# Altium schematic sheet Blues Brkr.SchDoc (part 3 of 3)
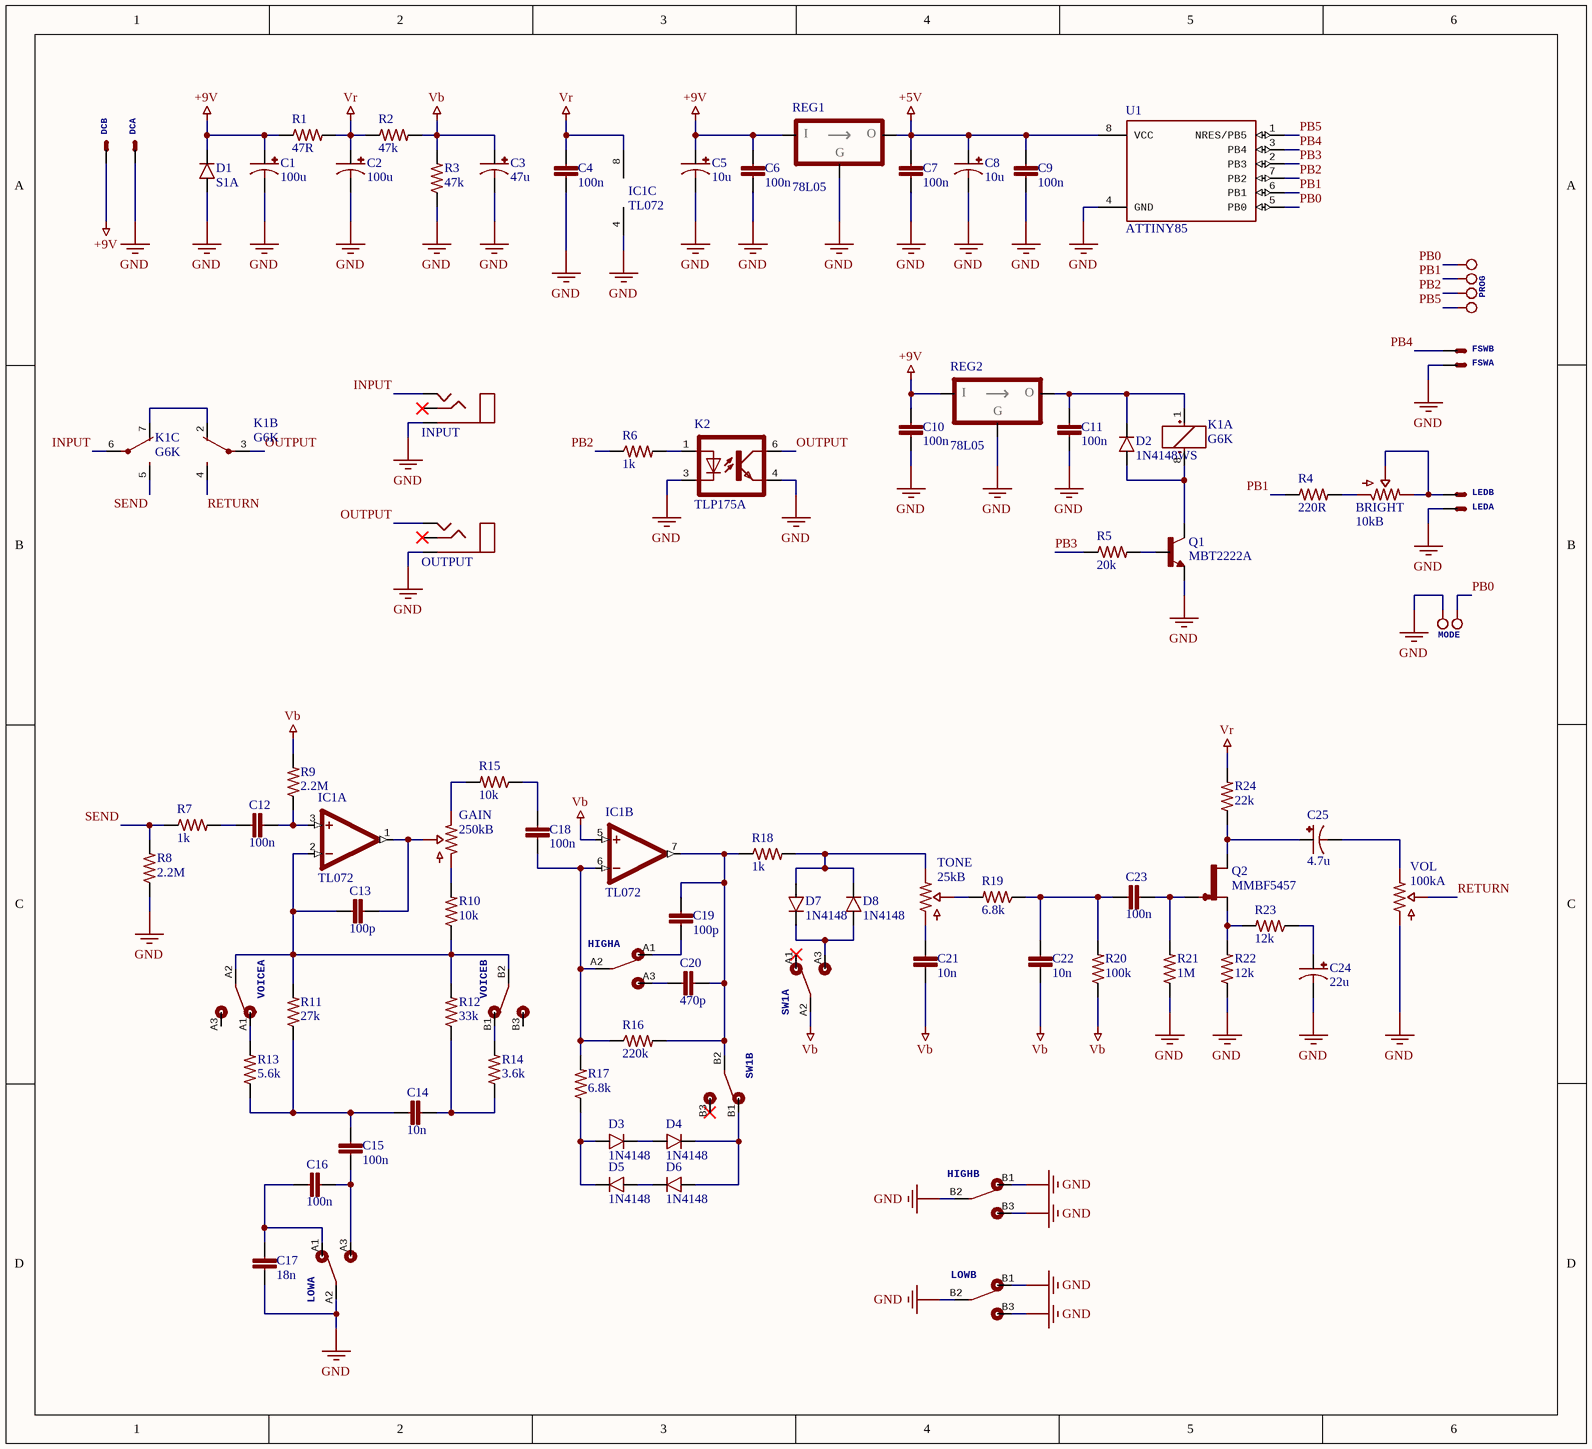
[diagram p2: Blues Brkr.SchDoc]

## Library data of the parts (continued)
R6 R7 R18 = CRCW06031K00FKEA: RES SMD 1K OHM 1% 1/10W 0603; Manufacturer: Vishay Dale; Resistance: 1kR; Temperature Coefficient: 100ppm/°C; Power Rating: 100mW; Voltage Rating: 75V; Supplier 1: Farnell; Supplier Part Number 1: 1469740; Manufacturer Part Number: CRCW06031K00FKEA; Stock: 1083345; Pricing: 10=0.017, 100=0.0131, 500=0.0114, 1000=0.008, 2500=0.0061 (EUR); RoHS: Yes; Mount: Surface Mount; Case/Package: 0603; Number of Pins: 2; Weight: 7.1E-05oz; Contact Plating: Tin; Case Code (Metric): 1608; Case Code (Imperial): 0603; Min Operating Temperature: -55°C; Max Operating Temperature: 155°C; Composition: Thick Film; Tolerance: 1%; Termination: SMD/SMT; Packaging: Tape and Reel; Package Quantity: 10; Number of Terminations: 2; Military Standard: Not; Max Power Dissipation: 100mW; Voltage Rating (DC): 75V; Features: Automotive AEC-Q200; Length: 1.55mm; Height: 0.45mm; Width: 0.033inch; Depth: 0.85mm; Radiation Hardening: No; Lead Free: Lead Free; REACH SVHC: Unknown; ComponentLink1URL: https://datasheet.ciiva.com/11808/0900766b80d98afc-11808625.pdf?src-supplier=RSComponents; ComponentLink1Description: https://datasheet.ciiva.com/11808/0900766b80d98afc-11808625.pdf?src-supplier=RSComponents; ComponentLink2URL: https://datasheet.ciiva.com/2465/dcrcwe3-2465536.pdf?src-supplier=Digi-Key; ComponentLink2Description: https://datasheet.ciiva.com/2465/dcrcwe3-2465536.pdf?src-supplier=Digi-Key; ComponentLink3URL: https://datasheet.ciiva.com/8336/dcrcwe3-8336822.pdf?src-supplier=Avnet; ComponentLink3Description: https://datasheet.ciiva.com/8336/dcrcwe3-8336822.pdf?src-supplier=Avnet; ComponentLink4URL: https://datasheet.ciiva.com/16515/dcrcwe3-16515078.pdf?src-supplier=Avnet+Asia; ComponentLink4Description: https://datasheet.ciiva.com/16515/dcrcwe3-16515078.pdf?src-supplier=Avnet+Asia; ComponentLink5URL: https://datasheet.ciiva.com/46441/1720486-46441622.pdf?src-supplier=Element14; ComponentLink5Description: https://datasheet.ciiva.com/46441/1720486-46441622.pdf?src-supplier=Element14; ComponentLink6URL: https://datasheet.ciiva.com/26316/fld-crcw-e3-data-en-26316551.pdf?src-supplier=Distrelec; ComponentLink6Description: https://datasheet.ciiva.com/26316/fld-crcw-e3-data-en-26316551.pdf?src-supplier=Distrelec; ComponentLink7URL: https://datasheet.ciiva.com/46441/1720486-46441623.pdf?src-supplier=Element14; ComponentLink7Description: https://datasheet.ciiva.com/46441/1720486-46441623.pdf?src-supplier=Element14; ComponentLink8URL: https://datasheet.ciiva.com/46385/1697337-46385497.pdf?src-supplier=Element14; ComponentLink8Description: https://datasheet.ciiva.com/46385/1697337-46385497.pdf?src-supplier=Element14; ComponentLink9URL: https://datasheet.ciiva.com/3257/dcrcwe3-3257132.pdf?src-supplier=Avnet; ComponentLink9Description: https://datasheet.ciiva.com/3257/dcrcwe3-3257132.pdf?src-supplier=Avnet; ComponentLink10URL: https://datasheet.ciiva.com/16199/dcrcwe3-16199053.pdf?src-supplier=Future+Electronics; ComponentLink10Description: https://datasheet.ciiva.com/16199/dcrcwe3-16199053.pdf?src-supplier=Future+Electronics; ComponentLink11URL: https://datasheet.ciiva.com/2465/dcrcwe3-2465534.pdf?src-supplier=Digi-Key; ComponentLink11Description: https://datasheet.ciiva.com/2465/dcrcwe3-2465534.pdf?src-supplier=Digi-Key; ComponentLink12URL: https://datasheet.ciiva.com/16893/dcrcwe3-16893742.pdf?src-supplier=Avnet+Europe; ComponentLink12Description: https://datasheet.ciiva.com/16893/dcrcwe3-16893742.pdf?src-supplier=Avnet+Europe; ComponentLink13URL: https://datasheet.ciiva.com/2465/dcrcwe3-2465535.pdf?src-supplier=Digi-Key; ComponentLink13Description: https://datasheet.ciiva.com/2465/dcrcwe3-2465535.pdf?src-supplier=Digi-Key; Price: 0.013
R8 R9 = CRCW06032M20FKEA: RES SMD 2.2M OHM 1% 1/10W 0603; Manufacturer: Vishay; Resistance: 2.2MR; Power Rating: 100mW; Temperature Coefficient: 100ppm/°C; Voltage Rating: 75V; Supplier 1: Farnell; Supplier Part Number 1: 2138646; Manufacturer Part Number: CRCW06032M20FKEA; Stock: 19125; Pricing: 10=0.0212, 100=0.0163, 500=0.0141, 1000=0.0073 (EUR); RoHS: Yes; Mount: Surface Mount; Case/Package: 0603; Number of Pins: 2; Weight: 7.1E-05oz; Contact Plating: Tin; Case Code (Imperial): 0603; Case Code (Metric): 1608; Min Operating Temperature: -55°C; Max Operating Temperature: 155°C; Tolerance: 1%; Packaging: Tape and Reel; Composition: Thick Film; Termination: SMD/SMT; Package Quantity: 10; Number of Terminations: 2; Military Standard: Not; Max Power Dissipation: 100mW; Voltage Rating (DC): 75V; Features: Automotive AEC-Q200; Length: 1.55mm; Height: 0.45mm; Width: 0.85mm; Depth: 0.85mm; Radiation Hardening: No; Lead Free: Lead Free; REACH SVHC: Unknown; ComponentLink1URL: https://datasheet.ciiva.com/11810/0900766b80d98afc-11810588.pdf?src-supplier=RSComponents; ComponentLink1Description: https://datasheet.ciiva.com/11810/0900766b80d98afc-11810588.pdf?src-supplier=RSComponents; ComponentLink2URL: https://datasheet.ciiva.com/2466/dcrcwe3-2466118.pdf?src-supplier=Digi-Key; ComponentLink2Description: https://datasheet.ciiva.com/2466/dcrcwe3-2466118.pdf?src-supplier=Digi-Key; ComponentLink3URL: https://datasheet.ciiva.com/22682/1912744-22682662.pdf?src-supplier=Element14; ComponentLink3Description: https://datasheet.ciiva.com/22682/1912744-22682662.pdf?src-supplier=Element14; ComponentLink4URL: https://datasheet.ciiva.com/7801/1697337-7801067.pdf?src-supplier=Element14; ComponentLink4Description: https://datasheet.ciiva.com/7801/1697337-7801067.pdf?src-supplier=Element14; ComponentLink5URL: https://datasheet.ciiva.com/22869/70201119-22869819.pdf?src-supplier=Allied+Electronics; ComponentLink5Description: https://datasheet.ciiva.com/22869/70201119-22869819.pdf?src-supplier=Allied+Electronics; ComponentLink6URL: https://datasheet.ciiva.com/26314/fld-crcw-e3-data-en-26314653.pdf?src-supplier=Distrelec; ComponentLink6Description: https://datasheet.ciiva.com/26314/fld-crcw-e3-data-en-26314653.pdf?src-supplier=Distrelec; ComponentLink7URL: https://datasheet.ciiva.com/3257/dcrcwe3-3257407.pdf?src-supplier=Avnet; ComponentLink7Description: https://datasheet.ciiva.com/3257/dcrcwe3-3257407.pdf?src-supplier=Avnet; ComponentLink8URL: https://datasheet.ciiva.com/2466/dcrcwe3-2466116.pdf?src-supplier=Digi-Key; ComponentLink8Description: https://datasheet.ciiva.com/2466/dcrcwe3-2466116.pdf?src-supplier=Digi-Key; ComponentLink9URL: https://datasheet.ciiva.com/2466/dcrcwe3-2466117.pdf?src-supplier=Digi-Key; ComponentLink9Description: https://datasheet.ciiva.com/2466/dcrcwe3-2466117.pdf?src-supplier=Digi-Key; ComponentLink10URL: https://datasheet.ciiva.com/16498/dcrcwe3-16498313.pdf?src-supplier=Future+Electronics; ComponentLink10Description: https://datasheet.ciiva.com/16498/dcrcwe3-16498313.pdf?src-supplier=Future+Electronics; ComponentLink11URL: https://datasheet.ciiva.com/7801/1697337-7801066.pdf?src-supplier=Element14; ComponentLink11Description: https://datasheet.ciiva.com/7801/1697337-7801066.pdf?src-supplier=Element14; Price: 0.0165
R10 R15 = CRCW060310K0FKEA: RES SMD 10K OHM 1% 1/10W 0603; Manufacturer: Vishay; Resistance: 10kR; Temperature Coefficient: 100ppm/°C; Power Rating: 100mW; Voltage Rating: 75V; Supplier 1: Farnell; Supplier Part Number 1: 1469748; Manufacturer Part Number: CRCW060310K0FKEA; Stock: 1391124; Pricing: 10=0.0169, 100=0.013, 500=0.0113, 1000=0.008 (EUR); RoHS: Yes; Case/Package: 0603; Number of Pins: 2; Weight: 7.1E-05oz; Contact Plating: Tin; Case Code (Metric): 1608; Case Code (Imperial): 0603; Min Operating Temperature: -55°C; Max Operating Temperature: 155°C; Tolerance: 1%; Composition: Thick Film; Packaging: Tape and Reel; Package Quantity: 10; Number of Terminations: 2; Military Standard: Not; Termination: SMD/SMT; Max Power Dissipation: 100mW; Voltage Rating (DC): 75V; Features: Automotive AEC-Q200; Length: 1.55mm; Height: 0.45mm; Width: 0.033inch; Depth: 0.85mm; Radiation Hardening: No; Lead Free: Lead Free; REACH SVHC: Unknown; ComponentLink1URL: https://datasheet.ciiva.com/11809/0900766b80d98afc-11809037.pdf?src-supplier=RSComponents; ComponentLink1Description: https://datasheet.ciiva.com/11809/0900766b80d98afc-11809037.pdf?src-supplier=RSComponents; ComponentLink2URL: https://datasheet.ciiva.com/16886/dcrcw-16886037.pdf?src-supplier=Avnet+Europe; ComponentLink2Description: https://datasheet.ciiva.com/16886/dcrcw-16886037.pdf?src-supplier=Avnet+Europe; ComponentLink3URL: https://datasheet.ciiva.com/26821/getdatasheetpartid-86831-26821109.pdf?src-supplier=Verical; ComponentLink3Description: https://datasheet.ciiva.com/26821/getdatasheetpartid-86831-26821109.pdf?src-supplier=Verical; ComponentLink4URL: https://datasheet.ciiva.com/16754/70201119-16754710.pdf?src-supplier=Allied+Electronics; ComponentLink4Description: https://datasheet.ciiva.com/16754/70201119-16754710.pdf?src-supplier=Allied+Electronics; ComponentLink5URL: https://datasheet.ciiva.com/16719/70201119-16719704.pdf?src-supplier=Allied+Electronics; ComponentLink5Description: https://datasheet.ciiva.com/16719/70201119-16719704.pdf?src-supplier=Allied+Electronics; ComponentLink6URL: https://datasheet.ciiva.com/2465/dcrcwe3-2465513.pdf?src-supplier=Digi-Key; ComponentLink6Description: https://datasheet.ciiva.com/2465/dcrcwe3-2465513.pdf?src-supplier=Digi-Key; ComponentLink7URL: https://datasheet.ciiva.com/5543/dcrcwe3-109170-5543001.pdf?src-supplier=Mouser; ComponentLink7Description: https://datasheet.ciiva.com/5543/dcrcwe3-109170-5543001.pdf?src-supplier=Mouser; ComponentLink8URL: https://datasheet.ciiva.com/2465/dcrcwe3-2465514.pdf?src-supplier=Digi-Key; ComponentLink8Description: https://datasheet.ciiva.com/2465/dcrcwe3-2465514.pdf?src-supplier=Digi-Key; ComponentLink9URL: https://datasheet.ciiva.com/46385/1697337-46385498.pdf?src-supplier=Element14; ComponentLink9Description: https://datasheet.ciiva.com/46385/1697337-46385498.pdf?src-supplier=Element14; ComponentLink10URL: https://datasheet.ciiva.com/2465/dcrcwe3-2465515.pdf?src-supplier=Digi-Key; ComponentLink10Description: https://datasheet.ciiva.com/2465/dcrcwe3-2465515.pdf?src-supplier=Digi-Key; ComponentLink11URL: https://datasheet.ciiva.com/3256/dcrcwe3-3256939.pdf?src-supplier=Avnet; ComponentLink11Description: https://datasheet.ciiva.com/3256/dcrcwe3-3256939.pdf?src-supplier=Avnet; ComponentLink12URL: https://datasheet.ciiva.com/3256/dcrcwe3-3256940.pdf?src-supplier=Avnet; ComponentLink12Description: https://datasheet.ciiva.com/3256/dcrcwe3-3256940.pdf?src-supplier=Avnet; ComponentLink13URL: https://datasheet.ciiva.com/16209/dcrcwe3-16209164.pdf?src-supplier=Future+Electronics; ComponentLink13Description: https://datasheet.ciiva.com/16209/dcrcwe3-16209164.pdf?src-supplier=Future+Electronics; ComponentLink14URL: https://datasheet.ciiva.com/26314/fld-crcw-e3-data-en-26314749.pdf?src-supplier=Distrelec; ComponentLink14Description: https://datasheet.ciiva.com/26314/fld-crcw-e3-data-en-26314749.pdf?src-supplier=Distrelec; Price: 0.0131
R11 = CRCW060327K0FKEA: RES SMD 27K OHM 1% 1/10W 0603; Manufacturer: Vishay; Resistance: 27kR; Power Rating: 100mW; Temperature Coefficient: 100ppm/°C; Voltage Rating: 75V; Supplier 1: Farnell; Supplier Part Number 1: 1652864; Manufacturer Part Number: CRCW060327K0FKEA; Stock: 74674; Pricing: 10=0.0169, 100=0.013, 500=0.0113, 1000=0.0068 (EUR); RoHS: Yes; Mount: Surface Mount; Case/Package: 0603; Number of Pins: 2; Weight: 7.1E-05oz; Contact Plating: Tin; Case Code (Imperial): 0603; Case Code (Metric): 1608; Min Operating Temperature: -55°C; Max Operating Temperature: 155°C; Tolerance: 1%; Composition: Thick Film; Packaging: Tape and Reel; Termination: SMD/SMT; Package Quantity: 10; Number of Terminations: 2; Military Standard: Not; Max Power Dissipation: 100mW; Voltage Rating (DC): 75V; Features: Automotive AEC-Q200; Length: 1.55mm; Height: 0.45mm; Width: 0.85mm; Depth: 0.85mm; Radiation Hardening: No; REACH SVHC: Unknown; Lead Free: Lead Free; ComponentLink1URL: https://datasheet.ciiva.com/11810/0900766b80d98afc-11810797.pdf?src-supplier=RSComponents; ComponentLink1Description: https://datasheet.ciiva.com/11810/0900766b80d98afc-11810797.pdf?src-supplier=RSComponents; ComponentLink2URL: https://datasheet.ciiva.com/7841/1697337-7841575.pdf?src-supplier=Element14; ComponentLink2Description: https://datasheet.ciiva.com/7841/1697337-7841575.pdf?src-supplier=Element14; ComponentLink3URL: https://datasheet.ciiva.com/15159/getdatasheetpartid-45808-15159562.pdf?src-supplier=Verical; ComponentLink3Description: https://datasheet.ciiva.com/15159/getdatasheetpartid-45808-15159562.pdf?src-supplier=Verical; ComponentLink4URL: https://datasheet.ciiva.com/26314/fld-crcw-e3-data-en-26314668.pdf?src-supplier=Distrelec; ComponentLink4Description: https://datasheet.ciiva.com/26314/fld-crcw-e3-data-en-26314668.pdf?src-supplier=Distrelec; ComponentLink5URL: https://datasheet.ciiva.com/2466/dcrcwe3-2466269.pdf?src-supplier=Digi-Key; ComponentLink5Description: https://datasheet.ciiva.com/2466/dcrcwe3-2466269.pdf?src-supplier=Digi-Key; ComponentLink6URL: https://datasheet.ciiva.com/2466/dcrcwe3-2466271.pdf?src-supplier=Digi-Key; ComponentLink6Description: https://datasheet.ciiva.com/2466/dcrcwe3-2466271.pdf?src-supplier=Digi-Key; ComponentLink7URL: https://datasheet.ciiva.com/16395/dcrcwe3-16395398.pdf?src-supplier=Future+Electronics; ComponentLink7Description: https://datasheet.ciiva.com/16395/dcrcwe3-16395398.pdf?src-supplier=Future+Electronics; ComponentLink8URL: https://datasheet.ciiva.com/16893/dcrcw-16893962.pdf?src-supplier=Avnet+Europe; ComponentLink8Description: https://datasheet.ciiva.com/16893/dcrcw-16893962.pdf?src-supplier=Avnet+Europe; ComponentLink9URL: https://datasheet.ciiva.com/2466/dcrcwe3-2466270.pdf?src-supplier=Digi-Key; ComponentLink9Description: https://datasheet.ciiva.com/2466/dcrcwe3-2466270.pdf?src-supplier=Digi-Key; ComponentLink10URL: https://datasheet.ciiva.com/22871/70201119-22871598.pdf?src-supplier=Allied+Electronics; ComponentLink10Description: https://datasheet.ciiva.com/22871/70201119-22871598.pdf?src-supplier=Allied+Electronics; Price: 0.0129
R12 = CRCW060333K0FKEA: RES SMD 33K OHM 1% 1/10W 0603; Manufacturer: Vishay; Resistance: 33kR; Temperature Coefficient: 100ppm/°C; Power Rating: 100mW; Voltage Rating: 75V; Supplier 1: Farnell; Supplier Part Number 1: 1469801; Manufacturer Part Number: CRCW060333K0FKEA; Stock: 69037; Pricing: 10=0.0112, 100=0.0092, 500=0.0084, 1000=0.0075 (EUR); RoHS: Yes; Mount: Surface Mount; Case/Package: 0603; Weight: 7.1E-05oz; Contact Plating: Tin; Case Code (Metric): 1608; Case Code (Imperial): 0603; Min Operating Temperature: -55°C; Max Operating Temperature: 155°C; Composition: Thick Film; Tolerance: 1%; Package Quantity: 10; Packaging: Tape and Reel; Number of Terminations: 2; Military Standard: Not; Termination: SMD/SMT; Max Power Dissipation: 100mW; Voltage Rating (DC): 75V; Features: Automotive AEC-Q200; Length: 1.55mm; Height: 0.45mm; Width: 0.033inch; Depth: 0.85mm; Radiation Hardening: No; REACH SVHC: Unknown; Lead Free: Lead Free; ComponentLink1URL: https://datasheet.ciiva.com/11809/0900766b80d98afc-11809071.pdf?src-supplier=RSComponents; ComponentLink1Description: https://datasheet.ciiva.com/11809/0900766b80d98afc-11809071.pdf?src-supplier=RSComponents; ComponentLink2URL: https://datasheet.ciiva.com/5547/dcrcwe3-109170-5547006.pdf?src-supplier=Mouser; ComponentLink2Description: https://datasheet.ciiva.com/5547/dcrcwe3-109170-5547006.pdf?src-supplier=Mouser; ComponentLink3URL: https://datasheet.ciiva.com/2525/dcrcwe3-2525247.pdf?src-supplier=Digi-Key; ComponentLink3Description: https://datasheet.ciiva.com/2525/dcrcwe3-2525247.pdf?src-supplier=Digi-Key; ComponentLink4URL: https://datasheet.ciiva.com/7841/1697337-7841829.pdf?src-supplier=Element14; ComponentLink4Description: https://datasheet.ciiva.com/7841/1697337-7841829.pdf?src-supplier=Element14; ComponentLink5URL: https://datasheet.ciiva.com/16884/dcrcwe3-16884901.pdf?src-supplier=Avnet+Europe; ComponentLink5Description: https://datasheet.ciiva.com/16884/dcrcwe3-16884901.pdf?src-supplier=Avnet+Europe; ComponentLink6URL: https://datasheet.ciiva.com/16777/70201119-16777127.pdf?src-supplier=Allied+Electronics; ComponentLink6Description: https://datasheet.ciiva.com/16777/70201119-16777127.pdf?src-supplier=Allied+Electronics; ComponentLink7URL: https://datasheet.ciiva.com/17045/dcrcwe3-17045447.pdf?src-supplier=Future+Electronics; ComponentLink7Description: https://datasheet.ciiva.com/17045/dcrcwe3-17045447.pdf?src-supplier=Future+Electronics; ComponentLink8URL: https://datasheet.ciiva.com/3257/dcrcwe3-3257468.pdf?src-supplier=Avnet; ComponentLink8Description: https://datasheet.ciiva.com/3257/dcrcwe3-3257468.pdf?src-supplier=Avnet; ComponentLink9URL: https://datasheet.ciiva.com/2525/dcrcwe3-2525245.pdf?src-supplier=Digi-Key; ComponentLink9Description: https://datasheet.ciiva.com/2525/dcrcwe3-2525245.pdf?src-supplier=Digi-Key; ComponentLink10URL: https://datasheet.ciiva.com/2525/dcrcwe3-2525246.pdf?src-supplier=Digi-Key; ComponentLink10Description: https://datasheet.ciiva.com/2525/dcrcwe3-2525246.pdf?src-supplier=Digi-Key; ComponentLink11URL: https://datasheet.ciiva.com/26314/fld-crcw-e3-data-en-26314670.pdf?src-supplier=Distrelec; ComponentLink11Description: https://datasheet.ciiva.com/26314/fld-crcw-e3-data-en-26314670.pdf?src-supplier=Distrelec; Price: 0.0093
R13 = CRCW06035K60FKEA: RES SMD 5.6K OHM 1% 1/10W 0603; Manufacturer: Vishay; Resistance: 5.6kR; Temperature Coefficient: 100ppm/°C; Power Rating: 100mW; Voltage Rating: 75V; Supplier 1: Farnell; Supplier Part Number 1: 1469820; Manufacturer Part Number: CRCW06035K60FKEA; Stock: 87511; Pricing: 10=0.0112, 100=0.0092, 500=0.0084, 1000=0.0061 (EUR); RoHS: Yes; Mount: Surface Mount; Case/Package: 0603; Number of Pins: 2; Weight: 7.1E-05oz; Contact Plating: Tin; Case Code (Imperial): 0603; Case Code (Metric): 1608; Min Operating Temperature: -55°C; Max Operating Temperature: 155°C; Tolerance: 1%; Composition: Thick Film; Packaging: Tape and Reel; Package Quantity: 5000; Termination: SMD/SMT; Voltage Rating (DC): 75V; Number of Terminations: 2; Military Standard: Not; Working Voltage: 75V; Length: 1.55mm; Height: 0.45mm; Width: 0.85mm; Depth: 0.85mm; Radiation Hardening: No; REACH SVHC: Unknown; Lead Free: Lead Free; ComponentLink1URL: https://datasheet.ciiva.com/3883/41405319s7915995n6892-3883091.pdf?src-supplier=Arrow; ComponentLink1Description: https://datasheet.ciiva.com/3883/41405319s7915995n6892-3883091.pdf?src-supplier=Arrow; ComponentLink2URL: https://datasheet.ciiva.com/11809/0900766b80d98afc-11809147.pdf?src-supplier=RSComponents; ComponentLink2Description: https://datasheet.ciiva.com/11809/0900766b80d98afc-11809147.pdf?src-supplier=RSComponents; ComponentLink3URL: https://datasheet.ciiva.com/26314/fld-crcw-e3-data-en-26314743.pdf?src-supplier=Distrelec; ComponentLink3Description: https://datasheet.ciiva.com/26314/fld-crcw-e3-data-en-26314743.pdf?src-supplier=Distrelec; ComponentLink4URL: https://datasheet.ciiva.com/16786/70201119-16786959.pdf?src-supplier=Allied+Electronics; ComponentLink4Description: https://datasheet.ciiva.com/16786/70201119-16786959.pdf?src-supplier=Allied+Electronics; ComponentLink5URL: https://datasheet.ciiva.com/3257/dcrcwe3-3257768.pdf?src-supplier=Avnet; ComponentLink5Description: https://datasheet.ciiva.com/3257/dcrcwe3-3257768.pdf?src-supplier=Avnet; ComponentLink6URL: https://datasheet.ciiva.com/3257/dcrcwe3-3257769.pdf?src-supplier=Avnet; ComponentLink6Description: https://datasheet.ciiva.com/3257/dcrcwe3-3257769.pdf?src-supplier=Avnet; ComponentLink7URL: https://datasheet.ciiva.com/7841/1697337-7841836.pdf?src-supplier=Element14; ComponentLink7Description: https://datasheet.ciiva.com/7841/1697337-7841836.pdf?src-supplier=Element14; ComponentLink8URL: https://datasheet.ciiva.com/7841/1697337-7841613.pdf?src-supplier=Element14; ComponentLink8Description: https://datasheet.ciiva.com/7841/1697337-7841613.pdf?src-supplier=Element14; Price: 0.0093
R14 = CRCW06033K60FKEA: RES SMD 3.6K OHM 1% 1/10W 0603; Manufacturer: Vishay; Resistance: 3.6kR; Temperature Coefficient: 100ppm/°C; Power Rating: 100mW; Voltage Rating: 75V; Supplier 1: Farnell; Supplier Part Number 1: 1652878; Manufacturer Part Number: CRCW06033K60FKEA; Stock: 57225; Pricing: 10=0.017, 100=0.0131, 500=0.0113, 1000=0.008, 2500=0.0051 (EUR); RoHS: Yes; Case/Package: 0603; Number of Pins: 2; Weight: 7.1E-05oz; Contact Plating: Tin; Case Code (Metric): 1608; Case Code (Imperial): 0603; Min Operating Temperature: -55°C; Max Operating Temperature: 155°C; Tolerance: 1%; Composition: Thick Film; Packaging: Tape and Reel; Package Quantity: 10; Number of Terminations: 2; Termination: SMD/SMT; Max Power Dissipation: 100mW; Features: Automotive AEC-Q200; Military Standard: Not; Voltage Rating (DC): 75V; Length: 1.55mm; Height: 0.45mm; Width: 0.033inch; Depth: 0.85mm; Radiation Hardening: No; Lead Free: Lead Free; REACH SVHC: Unknown; ComponentLink1URL: https://datasheet.ciiva.com/11810/0900766b80d98afc-11810669.pdf?src-supplier=RSComponents; ComponentLink1Description: https://datasheet.ciiva.com/11810/0900766b80d98afc-11810669.pdf?src-supplier=RSComponents; ComponentLink2URL: https://datasheet.ciiva.com/2494/dcrcwe3-2494897.pdf?src-supplier=Digi-Key; ComponentLink2Description: https://datasheet.ciiva.com/2494/dcrcwe3-2494897.pdf?src-supplier=Digi-Key; ComponentLink3URL: https://datasheet.ciiva.com/2494/dcrcwe3-2494898.pdf?src-supplier=Digi-Key; ComponentLink3Description: https://datasheet.ciiva.com/2494/dcrcwe3-2494898.pdf?src-supplier=Digi-Key; ComponentLink4URL: https://datasheet.ciiva.com/2494/dcrcwe3-2494899.pdf?src-supplier=Digi-Key; ComponentLink4Description: https://datasheet.ciiva.com/2494/dcrcwe3-2494899.pdf?src-supplier=Digi-Key; ComponentLink5URL: https://datasheet.ciiva.com/26314/fld-crcw-e3-data-en-26314717.pdf?src-supplier=Distrelec; ComponentLink5Description: https://datasheet.ciiva.com/26314/fld-crcw-e3-data-en-26314717.pdf?src-supplier=Distrelec; ComponentLink6URL: https://datasheet.ciiva.com/16893/dcrcwe3-16893333.pdf?src-supplier=Avnet+Europe; ComponentLink6Description: https://datasheet.ciiva.com/16893/dcrcwe3-16893333.pdf?src-supplier=Avnet+Europe; ComponentLink7URL: https://datasheet.ciiva.com/16334/dcrcwe3-16334886.pdf?src-supplier=Future+Electronics; ComponentLink7Description: https://datasheet.ciiva.com/16334/dcrcwe3-16334886.pdf?src-supplier=Future+Electronics; ComponentLink8URL: https://datasheet.ciiva.com/3257/dcrcwe3-3257549.pdf?src-supplier=Avnet; ComponentLink8Description: https://datasheet.ciiva.com/3257/dcrcwe3-3257549.pdf?src-supplier=Avnet; ComponentLink9URL: https://datasheet.ciiva.com/7679/1697337-7679101.pdf?src-supplier=Element14; ComponentLink9Description: https://datasheet.ciiva.com/7679/1697337-7679101.pdf?src-supplier=Element14; ComponentLink10URL: https://datasheet.ciiva.com/7679/1533075-7679261.pdf?src-supplier=Element14; ComponentLink10Description: https://datasheet.ciiva.com/7679/1533075-7679261.pdf?src-supplier=Element14; ComponentLink11URL: https://datasheet.ciiva.com/3257/dcrcwe3-3257550.pdf?src-supplier=Avnet; ComponentLink11Description: https://datasheet.ciiva.com/3257/dcrcwe3-3257550.pdf?src-supplier=Avnet; Price: 0.013
R16 = CRCW0603220KFKEA: RES SMD 220K OHM 1% 1/10W 0603; Manufacturer: Vishay; Resistance: 220kR; Power Rating: 100mW; Temperature Coefficient: 100ppm/°C; Voltage Rating: 75V; Supplier 1: Farnell; Supplier Part Number 1: 1469783; Manufacturer Part Number: CRCW0603220KFKEA; Stock: 34686; Pricing: 10=0.0212, 100=0.0163, 500=0.0141, 1000=0.008 (EUR); RoHS: Yes; Case/Package: 0603; Weight: 7.1E-05oz; Contact Plating: Tin; Case Code (Imperial): 0603; Case Code (Metric): 1608; Min Operating Temperature: -55°C; Max Operating Temperature: 155°C; Tolerance: 1%; Packaging: Tape and Reel; Composition: Thick Film; Termination: SMD/SMT; Package Quantity: 10; Number of Terminations: 2; Max Power Dissipation: 100mW; Features: Automotive AEC-Q200; Military Standard: Not; Voltage Rating (DC): 75V; Length: 1.55mm; Height: 0.45mm; Width: 0.85mm; Depth: 0.85mm; Radiation Hardening: No; Lead Free: Lead Free; REACH SVHC: Unknown; ComponentLink1URL: https://datasheet.ciiva.com/11810/0900766b80d98afc-11810043.pdf?src-supplier=RSComponents; ComponentLink1Description: https://datasheet.ciiva.com/11810/0900766b80d98afc-11810043.pdf?src-supplier=RSComponents; ComponentLink2URL: https://datasheet.ciiva.com/22870/70201119-22870101.pdf?src-supplier=Allied+Electronics; ComponentLink2Description: https://datasheet.ciiva.com/22870/70201119-22870101.pdf?src-supplier=Allied+Electronics; ComponentLink3URL: https://datasheet.ciiva.com/16775/70201119-16775304.pdf?src-supplier=Allied+Electronics; ComponentLink3Description: https://datasheet.ciiva.com/16775/70201119-16775304.pdf?src-supplier=Allied+Electronics; ComponentLink4URL: https://datasheet.ciiva.com/2465/dcrcwe3-2465579.pdf?src-supplier=Digi-Key; ComponentLink4Description: https://datasheet.ciiva.com/2465/dcrcwe3-2465579.pdf?src-supplier=Digi-Key; ComponentLink5URL: https://datasheet.ciiva.com/2465/dcrcwe3-2465581.pdf?src-supplier=Digi-Key; ComponentLink5Description: https://datasheet.ciiva.com/2465/dcrcwe3-2465581.pdf?src-supplier=Digi-Key; ComponentLink6URL: https://datasheet.ciiva.com/16883/dcrcwe3-16883373.pdf?src-supplier=Avnet+Europe; ComponentLink6Description: https://datasheet.ciiva.com/16883/dcrcwe3-16883373.pdf?src-supplier=Avnet+Europe; ComponentLink7URL: https://datasheet.ciiva.com/7673/1697337-7673294.pdf?src-supplier=Element14; ComponentLink7Description: https://datasheet.ciiva.com/7673/1697337-7673294.pdf?src-supplier=Element14; ComponentLink8URL: https://datasheet.ciiva.com/26317/fld-crcw-e3-data-en-26317173.pdf?src-supplier=Distrelec; ComponentLink8Description: https://datasheet.ciiva.com/26317/fld-crcw-e3-data-en-26317173.pdf?src-supplier=Distrelec; ComponentLink9URL: https://datasheet.ciiva.com/5551/dcrcwe3-109170-5551287.pdf?src-supplier=Mouser; ComponentLink9Description: https://datasheet.ciiva.com/5551/dcrcwe3-109170-5551287.pdf?src-supplier=Mouser; ComponentLink10URL: https://datasheet.ciiva.com/2465/dcrcwe3-2465580.pdf?src-supplier=Digi-Key; ComponentLink10Description: https://datasheet.ciiva.com/2465/dcrcwe3-2465580.pdf?src-supplier=Digi-Key; ComponentLink11URL: https://datasheet.ciiva.com/3257/dcrcwe3-3257262.pdf?src-supplier=Avnet; ComponentLink11Description: https://datasheet.ciiva.com/3257/dcrcwe3-3257262.pdf?src-supplier=Avnet; Price: 0.0093
R17 R19 = CRCW06036K80FKEA: RES SMD 6.8K OHM 1% 1/10W 0603; Manufacturer: Vishay; Resistance: 6.8kR; Power Rating: 100mW; Temperature Coefficient: 100ppm/°C; Voltage Rating: 75V; Supplier 1: Farnell; Supplier Part Number 1: 1469831; Manufacturer Part Number: CRCW06036K80FKEA; Stock: 33883; Pricing: 10=0.0111, 100=0.0092, 500=0.0084, 1000=0.0061 (EUR); RoHS: Yes; Case/Package: 0603; Weight: 7.1E-05oz; Case Code (Metric): 1608; Case Code (Imperial): 0603; Contact Plating: Tin; Min Operating Temperature: -55°C; Max Operating Temperature: 155°C; Tolerance: 1%; Packaging: Tape and Reel; Composition: Thick Film; Termination: SMD/SMT; Package Quantity: 10; Number of Terminations: 2; Military Standard: Not; Max Power Dissipation: 100mW; Voltage Rating (DC): 75V; Features: Automotive AEC-Q200; Length: 1.55mm; Height: 0.45mm; Width: 0.033inch; Depth: 0.85mm; Radiation Hardening: No; Lead Free: Lead Free; REACH SVHC: Unknown; ComponentLink1URL: https://datasheet.ciiva.com/11811/0900766b80d98afc-11811920.pdf?src-supplier=RSComponents; ComponentLink1Description: https://datasheet.ciiva.com/11811/0900766b80d98afc-11811920.pdf?src-supplier=RSComponents; ComponentLink2URL: https://datasheet.ciiva.com/2465/dcrcwe3-2465684.pdf?src-supplier=Digi-Key; ComponentLink2Description: https://datasheet.ciiva.com/2465/dcrcwe3-2465684.pdf?src-supplier=Digi-Key; ComponentLink3URL: https://datasheet.ciiva.com/22870/70201119-22870027.pdf?src-supplier=Allied+Electronics; ComponentLink3Description: https://datasheet.ciiva.com/22870/70201119-22870027.pdf?src-supplier=Allied+Electronics; ComponentLink4URL: https://datasheet.ciiva.com/2465/dcrcwe3-2465685.pdf?src-supplier=Digi-Key; ComponentLink4Description: https://datasheet.ciiva.com/2465/dcrcwe3-2465685.pdf?src-supplier=Digi-Key; ComponentLink5URL: https://datasheet.ciiva.com/2465/dcrcwe3-2465686.pdf?src-supplier=Digi-Key; ComponentLink5Description: https://datasheet.ciiva.com/2465/dcrcwe3-2465686.pdf?src-supplier=Digi-Key; ComponentLink6URL: https://datasheet.ciiva.com/3257/dcrcwe3-3257852.pdf?src-supplier=Avnet; ComponentLink6Description: https://datasheet.ciiva.com/3257/dcrcwe3-3257852.pdf?src-supplier=Avnet; ComponentLink7URL: https://datasheet.ciiva.com/16508/dcrcwe3-16508431.pdf?src-supplier=Future+Electronics; ComponentLink7Description: https://datasheet.ciiva.com/16508/dcrcwe3-16508431.pdf?src-supplier=Future+Electronics; ComponentLink8URL: https://datasheet.ciiva.com/26314/fld-crcw-e3-data-en-26314745.pdf?src-supplier=Distrelec; ComponentLink8Description: https://datasheet.ciiva.com/26314/fld-crcw-e3-data-en-26314745.pdf?src-supplier=Distrelec; ComponentLink9URL: https://datasheet.ciiva.com/16771/70201119-16771274.pdf?src-supplier=Allied+Electronics; ComponentLink9Description: https://datasheet.ciiva.com/16771/70201119-16771274.pdf?src-supplier=Allied+Electronics; ComponentLink10URL: https://datasheet.ciiva.com/7673/1697337-7673148.pdf?src-supplier=Element14; ComponentLink10Description: https://datasheet.ciiva.com/7673/1697337-7673148.pdf?src-supplier=Element14; ComponentLink11URL: https://datasheet.ciiva.com/3257/dcrcwe3-3257853.pdf?src-supplier=Avnet; ComponentLink11Description: https://datasheet.ciiva.com/3257/dcrcwe3-3257853.pdf?src-supplier=Avnet; Price: 0.0093
R20 = CRCW0603100KFKEA: RES SMD 100K OHM 1% 1/10W 0603; Manufacturer: Vishay; Resistance: 100kR; Temperature Coefficient: 100ppm/°C; Power Rating: 100mW; Voltage Rating: 75V; Supplier 1: Farnell; Supplier Part Number 1: 1469649; Manufacturer Part Number: CRCW0603100KFKEA; Stock: 573766; Pricing: 10=0.0169, 100=0.013, 500=0.0113, 1000=0.0068 (EUR); RoHS: Yes; Case/Package: 0603; Number of Pins: 2; Weight: 7.1E-05oz; Contact Plating: Tin; Case Code (Metric): 1608; Case Code (Imperial): 0603; Min Operating Temperature: -55°C; Max Operating Temperature: 155°C; Tolerance: 1%; Composition: Thick Film; Termination: SMD/SMT; Packaging: Tape and Reel; Package Quantity: 10; Number of Terminations: 2; Military Standard: Not; Max Power Dissipation: 100mW; Voltage Rating (DC): 75V; Features: Automotive AEC-Q200; Length: 1.55mm; Height: 0.45mm; Width: 0.033inch; Depth: 0.85mm; Radiation Hardening: No; Lead Free: Lead Free; REACH SVHC: Unknown; ComponentLink1URL: https://datasheet.ciiva.com/11809/0900766b80d98afc-11809004.pdf?src-supplier=RSComponents; ComponentLink1Description: https://datasheet.ciiva.com/11809/0900766b80d98afc-11809004.pdf?src-supplier=RSComponents; ComponentLink2URL: https://datasheet.ciiva.com/2465/dcrcwe3-2465525.pdf?src-supplier=Digi-Key; ComponentLink2Description: https://datasheet.ciiva.com/2465/dcrcwe3-2465525.pdf?src-supplier=Digi-Key; ComponentLink3URL: https://datasheet.ciiva.com/7777/1697337-7777269.pdf?src-supplier=Element14; ComponentLink3Description: https://datasheet.ciiva.com/7777/1697337-7777269.pdf?src-supplier=Element14; ComponentLink4URL: https://datasheet.ciiva.com/15159/getdatasheetpartid-93113-15159925.pdf?src-supplier=Verical; ComponentLink4Description: https://datasheet.ciiva.com/15159/getdatasheetpartid-93113-15159925.pdf?src-supplier=Verical; ComponentLink5URL: https://datasheet.ciiva.com/46441/1720486-46441605.pdf?src-supplier=Element14; ComponentLink5Description: https://datasheet.ciiva.com/46441/1720486-46441605.pdf?src-supplier=Element14; ComponentLink6URL: https://datasheet.ciiva.com/2465/dcrcwe3-2465526.pdf?src-supplier=Digi-Key; ComponentLink6Description: https://datasheet.ciiva.com/2465/dcrcwe3-2465526.pdf?src-supplier=Digi-Key; ComponentLink7URL: https://datasheet.ciiva.com/2465/dcrcwe3-2465527.pdf?src-supplier=Digi-Key; ComponentLink7Description: https://datasheet.ciiva.com/2465/dcrcwe3-2465527.pdf?src-supplier=Digi-Key; ComponentLink8URL: https://datasheet.ciiva.com/8340/dcrcwe3-8340199.pdf?src-supplier=Avnet; ComponentLink8Description: https://datasheet.ciiva.com/8340/dcrcwe3-8340199.pdf?src-supplier=Avnet; ComponentLink9URL: https://datasheet.ciiva.com/16725/70201119-16725223.pdf?src-supplier=Allied+Electronics; ComponentLink9Description: https://datasheet.ciiva.com/16725/70201119-16725223.pdf?src-supplier=Allied+Electronics; ComponentLink10URL: https://datasheet.ciiva.com/8340/dcrcwe3-8340201.pdf?src-supplier=Avnet; ComponentLink10Description: https://datasheet.ciiva.com/8340/dcrcwe3-8340201.pdf?src-supplier=Avnet; ComponentLink11URL: https://datasheet.ciiva.com/7791/66915-7791994.pdf?src-supplier=Element14; ComponentLink11Description: https://datasheet.ciiva.com/7791/66915-7791994.pdf?src-supplier=Element14; ComponentLink12URL: https://datasheet.ciiva.com/5545/dcrcwe3-109170-5545100.pdf?src-supplier=Mouser; ComponentLink12Description: https://datasheet.ciiva.com/5545/dcrcwe3-109170-5545100.pdf?src-supplier=Mouser; ComponentLink13URL: https://datasheet.ciiva.com/26317/fld-crcw-e3-data-en-26317165.pdf?src-supplier=Distrelec; ComponentLink13Description: https://datasheet.ciiva.com/26317/fld-crcw-e3-data-en-26317165.pdf?src-supplier=Distrelec; ComponentLink14URL: https://datasheet.ciiva.com/16941/dcrcw-16941311.pdf?src-supplier=Avnet+Europe; ComponentLink14Description: https://datasheet.ciiva.com/16941/dcrcw-16941311.pdf?src-supplier=Avnet+Europe; Price: 0.0136
R21 = CRCW06031M00FKEA: RES SMD 1M OHM 1% 1/10W 0603; Manufacturer: Vishay; Resistance: 1MR; Temperature Coefficient: 100ppm/°C; Power Rating: 100mW; Voltage Rating: 75V; Supplier 1: Farnell; Supplier Part Number 1: 1469746; Manufacturer Part Number: CRCW06031M00FKEA; Stock: 118520; Pricing: 10=0.0169, 100=0.013, 500=0.0113, 1000=0.008 (EUR); RoHS: Yes; Mount: Surface Mount; Case/Package: 0603; Number of Pins: 2; Weight: 7.1E-05oz; Contact Plating: Tin; Case Code (Imperial): 0603; Case Code (Metric): 1608; Min Operating Temperature: -55°C; Max Operating Temperature: 155°C; Tolerance: 1%; Composition: Thick Film; Termination: SMD/SMT; Packaging: Tape and Reel; Package Quantity: 10; Number of Terminations: 2; Max Power Dissipation: 100mW; Features: Automotive AEC-Q200; Military Standard: Not; Voltage Rating (DC): 75V; Length: 1.55mm; Height: 0.45mm; Width: 0.85mm; Depth: 0.85mm; Radiation Hardening: No; Lead Free: Lead Free; REACH SVHC: Unknown; ComponentLink1URL: https://datasheet.ciiva.com/11809/0900766b80d98afc-11809074.pdf?src-supplier=RSComponents; ComponentLink1Description: https://datasheet.ciiva.com/11809/0900766b80d98afc-11809074.pdf?src-supplier=RSComponents; ComponentLink2URL: https://datasheet.ciiva.com/26314/fld-crcw-e3-data-en-26314645.pdf?src-supplier=Distrelec; ComponentLink2Description: https://datasheet.ciiva.com/26314/fld-crcw-e3-data-en-26314645.pdf?src-supplier=Distrelec; ComponentLink3URL: https://datasheet.ciiva.com/2465/dcrcwe3-2465549.pdf?src-supplier=Digi-Key; ComponentLink3Description: https://datasheet.ciiva.com/2465/dcrcwe3-2465549.pdf?src-supplier=Digi-Key; ComponentLink4URL: https://datasheet.ciiva.com/16311/dcrcwe3-16311533.pdf?src-supplier=Future+Electronics; ComponentLink4Description: https://datasheet.ciiva.com/16311/dcrcwe3-16311533.pdf?src-supplier=Future+Electronics; ComponentLink5URL: https://datasheet.ciiva.com/2465/dcrcwe3-2465550.pdf?src-supplier=Digi-Key; ComponentLink5Description: https://datasheet.ciiva.com/2465/dcrcwe3-2465550.pdf?src-supplier=Digi-Key; ComponentLink6URL: https://datasheet.ciiva.com/7841/1720486-7841822.pdf?src-supplier=Element14; ComponentLink6Description: https://datasheet.ciiva.com/7841/1720486-7841822.pdf?src-supplier=Element14; ComponentLink7URL: https://datasheet.ciiva.com/2465/dcrcwe3-2465551.pdf?src-supplier=Digi-Key; ComponentLink7Description: https://datasheet.ciiva.com/2465/dcrcwe3-2465551.pdf?src-supplier=Digi-Key; ComponentLink8URL: https://datasheet.ciiva.com/7841/125364-7841823.pdf?src-supplier=Element14; ComponentLink8Description: https://datasheet.ciiva.com/7841/125364-7841823.pdf?src-supplier=Element14; Price: 0.0131
R22 R23 = CRCW060312K0FKEA: RES SMD 12K OHM 1% 1/10W 0603; Manufacturer: Vishay; Resistance: 12kR; Temperature Coefficient: 100ppm/°C; Power Rating: 100mW; Voltage Rating: 75V; Supplier 1: Farnell; Supplier Part Number 1: 1652834; Manufacturer Part Number: CRCW060312K0FKEA; Stock: 58266; Pricing: 10=0.0169, 100=0.013, 500=0.0113, 1000=0.0068 (EUR); RoHS: Yes; Mount: Surface Mount; Case/Package: 0603; Weight: 7.1E-05oz; Contact Plating: Tin; Case Code (Metric): 1608; Case Code (Imperial): 0603; Min Operating Temperature: -55°C; Max Operating Temperature: 155°C; Tolerance: 1%; Composition: Thick Film; Package Quantity: 10; Packaging: Tape and Reel; Number of Terminations: 2; Termination: SMD/SMT; Military Standard: Not; Max Power Dissipation: 100mW; Voltage Rating (DC): 75V; Features: Automotive AEC-Q200; Length: 1.55mm; Height: 0.45mm; Width: 0.033inch; Depth: 0.85mm; Radiation Hardening: No; REACH SVHC: Unknown; Lead Free: Lead Free; ComponentLink1URL: https://datasheet.ciiva.com/11811/0900766b80d98afc-11811312.pdf?src-supplier=RSComponents; ComponentLink1Description: https://datasheet.ciiva.com/11811/0900766b80d98afc-11811312.pdf?src-supplier=RSComponents; ComponentLink2URL: https://datasheet.ciiva.com/2466/dcrcwe3-2466560.pdf?src-supplier=Digi-Key; ComponentLink2Description: https://datasheet.ciiva.com/2466/dcrcwe3-2466560.pdf?src-supplier=Digi-Key; ComponentLink3URL: https://datasheet.ciiva.com/2466/dcrcwe3-2466561.pdf?src-supplier=Digi-Key; ComponentLink3Description: https://datasheet.ciiva.com/2466/dcrcwe3-2466561.pdf?src-supplier=Digi-Key; ComponentLink4URL: https://datasheet.ciiva.com/2466/dcrcwe3-2466562.pdf?src-supplier=Digi-Key; ComponentLink4Description: https://datasheet.ciiva.com/2466/dcrcwe3-2466562.pdf?src-supplier=Digi-Key; ComponentLink5URL: https://datasheet.ciiva.com/16430/dcrcwe3-16430069.pdf?src-supplier=Future+Electronics; ComponentLink5Description: https://datasheet.ciiva.com/16430/dcrcwe3-16430069.pdf?src-supplier=Future+Electronics; ComponentLink6URL: https://datasheet.ciiva.com/16515/dcrcwe3-16515029.pdf?src-supplier=Avnet+Asia; ComponentLink6Description: https://datasheet.ciiva.com/16515/dcrcwe3-16515029.pdf?src-supplier=Avnet+Asia; ComponentLink7URL: https://datasheet.ciiva.com/3256/dcrcwe3-3256998.pdf?src-supplier=Avnet; ComponentLink7Description: https://datasheet.ciiva.com/3256/dcrcwe3-3256998.pdf?src-supplier=Avnet; ComponentLink8URL: https://datasheet.ciiva.com/5545/dcrcwe3-109170-5545254.pdf?src-supplier=Mouser; ComponentLink8Description: https://datasheet.ciiva.com/5545/dcrcwe3-109170-5545254.pdf?src-supplier=Mouser; ComponentLink9URL: https://datasheet.ciiva.com/3256/dcrcwe3-3256999.pdf?src-supplier=Avnet; ComponentLink9Description: https://datasheet.ciiva.com/3256/dcrcwe3-3256999.pdf?src-supplier=Avnet; ComponentLink10URL: https://datasheet.ciiva.com/7841/1533075-7841820.pdf?src-supplier=Element14; ComponentLink10Description: https://datasheet.ciiva.com/7841/1533075-7841820.pdf?src-supplier=Element14; ComponentLink11URL: https://datasheet.ciiva.com/16885/dcrcwe3-16885263.pdf?src-supplier=Avnet+Europe; ComponentLink11Description: https://datasheet.ciiva.com/16885/dcrcwe3-16885263.pdf?src-supplier=Avnet+Europe; Price: 0.0074
R24 = CRCW060322K0FKEA: RES SMD 22K OHM 1% 1/10W 0603; Manufacturer: Vishay; Resistance: 22kR; Temperature Coefficient: 100ppm/°C; Power Rating: 100mW; Voltage Rating: 75V; Supplier 1: Farnell; Supplier Part Number 1: 1469779; Manufacturer Part Number: CRCW060322K0FKEA; Stock: 139047; Pricing: 10=0.0169, 100=0.013, 500=0.0113, 1000=0.008 (EUR); RoHS: Yes; Mount: Surface Mount; Case/Package: 0603; Weight: 7.1E-05oz; Contact Plating: Tin; Case Code (Imperial): 0603; Case Code (Metric): 1608; Min Operating Temperature: -55°C; Max Operating Temperature: 155°C; Composition: Thick Film; Tolerance: 1%; Termination: SMD/SMT; Packaging: Tape and Reel; Package Quantity: 10; Number of Terminations: 2; Military Standard: Not; Max Power Dissipation: 100mW; Voltage Rating (DC): 75V; Features: Automotive AEC-Q200; Length: 1.55mm; Height: 0.45mm; Width: 0.85mm; Depth: 0.85mm; Radiation Hardening: No; Lead Free: Lead Free; REACH SVHC: Unknown; ComponentLink1URL: https://datasheet.ciiva.com/11818/0900766b80d98afc-11818177.pdf?src-supplier=RSComponents; ComponentLink1Description: https://datasheet.ciiva.com/11818/0900766b80d98afc-11818177.pdf?src-supplier=RSComponents; ComponentLink2URL: https://datasheet.ciiva.com/15159/getdatasheetpartid-32846-15159349.pdf?src-supplier=Verical; ComponentLink2Description: https://datasheet.ciiva.com/15159/getdatasheetpartid-32846-15159349.pdf?src-supplier=Verical; ComponentLink3URL: https://datasheet.ciiva.com/2466/dcrcwe3-2466263.pdf?src-supplier=Digi-Key; ComponentLink3Description: https://datasheet.ciiva.com/2466/dcrcwe3-2466263.pdf?src-supplier=Digi-Key; ComponentLink4URL: https://datasheet.ciiva.com/7672/1697337-7672871.pdf?src-supplier=Element14; ComponentLink4Description: https://datasheet.ciiva.com/7672/1697337-7672871.pdf?src-supplier=Element14; ComponentLink5URL: https://datasheet.ciiva.com/2466/dcrcwe3-2466264.pdf?src-supplier=Digi-Key; ComponentLink5Description: https://datasheet.ciiva.com/2466/dcrcwe3-2466264.pdf?src-supplier=Digi-Key; ComponentLink6URL: https://datasheet.ciiva.com/7673/1720486-7673144.pdf?src-supplier=Element14; ComponentLink6Description: https://datasheet.ciiva.com/7673/1720486-7673144.pdf?src-supplier=Element14; ComponentLink7URL: https://datasheet.ciiva.com/16427/dcrcwe3-16427336.pdf?src-supplier=Future+Electronics; ComponentLink7Description: https://datasheet.ciiva.com/16427/dcrcwe3-16427336.pdf?src-supplier=Future+Electronics; ComponentLink8URL: https://datasheet.ciiva.com/16893/dcrcwe3-16893896.pdf?src-supplier=Avnet+Europe; ComponentLink8Description: https://datasheet.ciiva.com/16893/dcrcwe3-16893896.pdf?src-supplier=Avnet+Europe; ComponentLink9URL: https://datasheet.ciiva.com/2466/dcrcwe3-2466265.pdf?src-supplier=Digi-Key; ComponentLink9Description: https://datasheet.ciiva.com/2466/dcrcwe3-2466265.pdf?src-supplier=Digi-Key; ComponentLink10URL: https://datasheet.ciiva.com/8339/dcrcwe3-8339961.pdf?src-supplier=Avnet; ComponentLink10Description: https://datasheet.ciiva.com/8339/dcrcwe3-8339961.pdf?src-supplier=Avnet; ComponentLink11URL: https://datasheet.ciiva.com/16767/70201119-16767417.pdf?src-supplier=Allied+Electronics; ComponentLink11Description: https://datasheet.ciiva.com/16767/70201119-16767417.pdf?src-supplier=Allied+Electronics; ComponentLink12URL: https://datasheet.ciiva.com/26314/fld-crcw-e3-data-en-26314666.pdf?src-supplier=Distrelec; ComponentLink12Description: https://datasheet.ciiva.com/26314/fld-crcw-e3-data-en-26314666.pdf?src-supplier=Distrelec; Price: 0.013
REG1 REG2 = TS78L05CXRFG: TAIWAN SEMICONDUCTOR - TS78L05CX RFG - REG 3-TERMINAL 100MA, SMD, SOT23-3; Min Input Voltage: 0uV; Max Input Voltage: 35V; Number of Outputs: 1; Nominal Output Voltage: 5V; Supplier 1: Farnell; Supplier Part Number 1: 1476698; Manufacturer: Taiwan Semiconductor; Manufacturer Part Number: TS78L05CXRFG; Stock: 0; Pricing: 5=0.101, 50=0.099, 100=0.097, 250=0.0949, 500=0.0929, 1000=0.0909, 5000=0.0889, 10000=0.0869 (EUR); RoHS: Yes; Case/Package: SOT-23; Number of Pins: 3; Min Operating Temperature: 0°C; Max Operating Temperature: 125°C; Output Current: 100mA; Packaging: Cut Tape; REACH SVHC: No SVHC; ComponentLink1URL: http://www.farnell.com/datasheets/2044138.pdf?src-supplier=Farnell; ComponentLink1Description: http://www.farnell.com/datasheets/2044138.pdf?src-supplier=Farnell; ComponentLink2URL: http://www.farnell.com/datasheets/4546.pdf?src-supplier=Element14; ComponentLink2Description: http://www.farnell.com/datasheets/4546.pdf?src-supplier=Element14; ComponentLink3URL: http://www.taiwansemi.com/products/datasheet/TS78L00_I15.pdf?src-supplier=Digi-Key; ComponentLink3Description: http://www.taiwansemi.com/products/datasheet/TS78L00_I15.pdf?src-supplier=Digi-Key; Price: 0.262
SW1 = DPDT_ON-OFF-ON: DPDT toggle switch ON/OFF/ON; Price: 0.5
TONE = 25kB_ALPHA_16mm: 25k Lin potentiometer round shaft; Price: 0.5; Dimensions: 16mm; Package: PCB Mounted
U1 = ATTINY85-20SU: IC, 8BIT MCU, AVR TINY, 20MHZ, 8-SOIC; Manufacturer: Microchip / Atmel; Memory Type: FLASH; Memory Size: 8KB; Number of Timers/Counters: 2; RAM Size: 512B; Interface: SPI; Max Supply Voltage: 5.5V; Min Supply Voltage: 2.7V; Number of I/Os: 6; Oscillator Type: Internal; Peripherals: Brown-out Detect/Reset; Data Bus Width: 8b; Watchdog Timer: Yes; Number of ADC Channels: 4; Number of UART Channels: 1; Access Time: 20us; Supplier 1: Farnell; Supplier Part Number 1: 1455164; Manufacturer Part Number: ATTINY85-20SU; Stock: 2172; Pricing: 1=0.972, 25=0.925, 100=0.894, 1000=0.862 (EUR); RoHS: Yes; Mount: Surface Mount; Case/Package: SOIC; Number of Pins: 8; Contact Plating: Tin; Min Operating Temperature: -40°C; Max Operating Temperature: 85°C; Frequency: 20MHz; Packaging: Rail/Tube; Core Architecture: AVR; Package Quantity: 95; Number of Programmable I/O: 6; Max Frequency: 20MHz; Number of PWM Channels: 6; Density: 8KB; Number of SPI Channels: 1; Number of I2C Channels: 1; Termination: SMD/SMT; Length: 5.35mm; Height: 1.91mm; Width: 5.4mm; Radiation Hardening: No; Lead Free: Lead Free; REACH SVHC: No SVHC; ComponentLink1URL: https://datasheet.ciiva.com/1167/1698186-1167152.pdf?src-supplier=Newark; ComponentLink1Description: https://datasheet.ciiva.com/1167/1698186-1167152.pdf?src-supplier=Newark; ComponentLink2URL: https://datasheet.ciiva.com/15122/getdatasheetpartid-131914-15122511.pdf?src-supplier=Verical; ComponentLink2Description: https://datasheet.ciiva.com/15122/getdatasheetpartid-131914-15122511.pdf?src-supplier=Verical; ComponentLink3URL: https://datasheet.ciiva.com/26207/doc2586-26207573.pdf?src-supplier=Avnet+Europe; ComponentLink3Description: https://datasheet.ciiva.com/26207/doc2586-26207573.pdf?src-supplier=Avnet+Europe; ComponentLink4URL: https://datasheet.ciiva.com/28653/1698186-28653829.pdf?src-supplier=Element14; ComponentLink4Description: https://datasheet.ciiva.com/28653/1698186-28653829.pdf?src-supplier=Element14; ComponentLink5URL: https://datasheet.ciiva.com/3203/doc2586-3203150.pdf?src-supplier=Avnet; ComponentLink5Description: https://datasheet.ciiva.com/3203/doc2586-3203150.pdf?src-supplier=Avnet; Price: 0.98
VOICE = SW_SLIDE_DPDT_ON-ON: DPDT slide switch ON/ON; Price: 0.5
VOL = 100kA_ALPHA_16mm: 100k Log potentiometer round shaft; Price: 0.5; Dimensions: 16mm; Package: PCB Mounted

## Notes on the sheet
- (in symbol TS78L05CXRFG) I; O; G